# Altium schematic sheet WP75xx 2 no usb_v.SchDoc
size 302 x 466 mm; Origin: Eagle
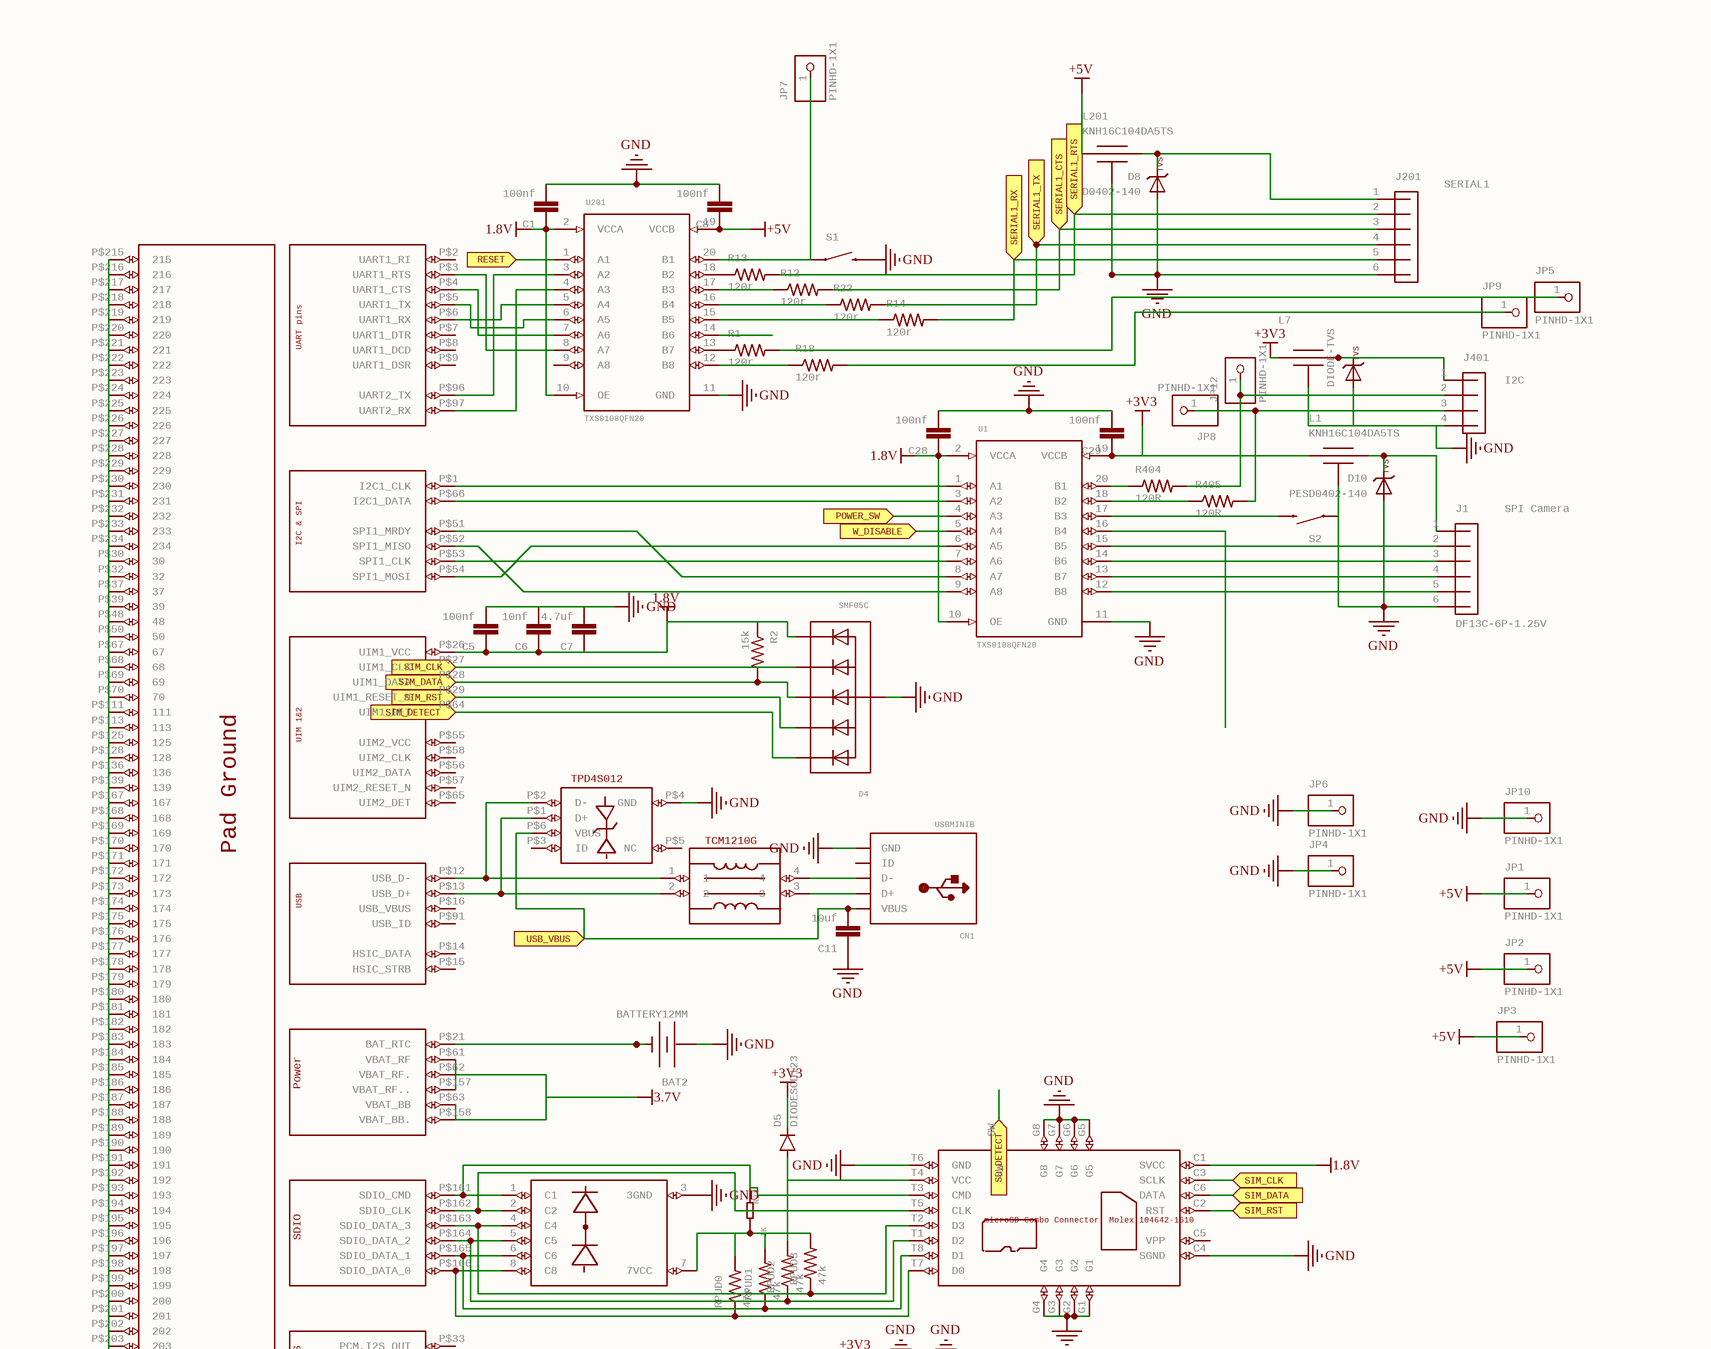
[diagram p0: WP75xx 2 no usb_v.SchDoc, top]
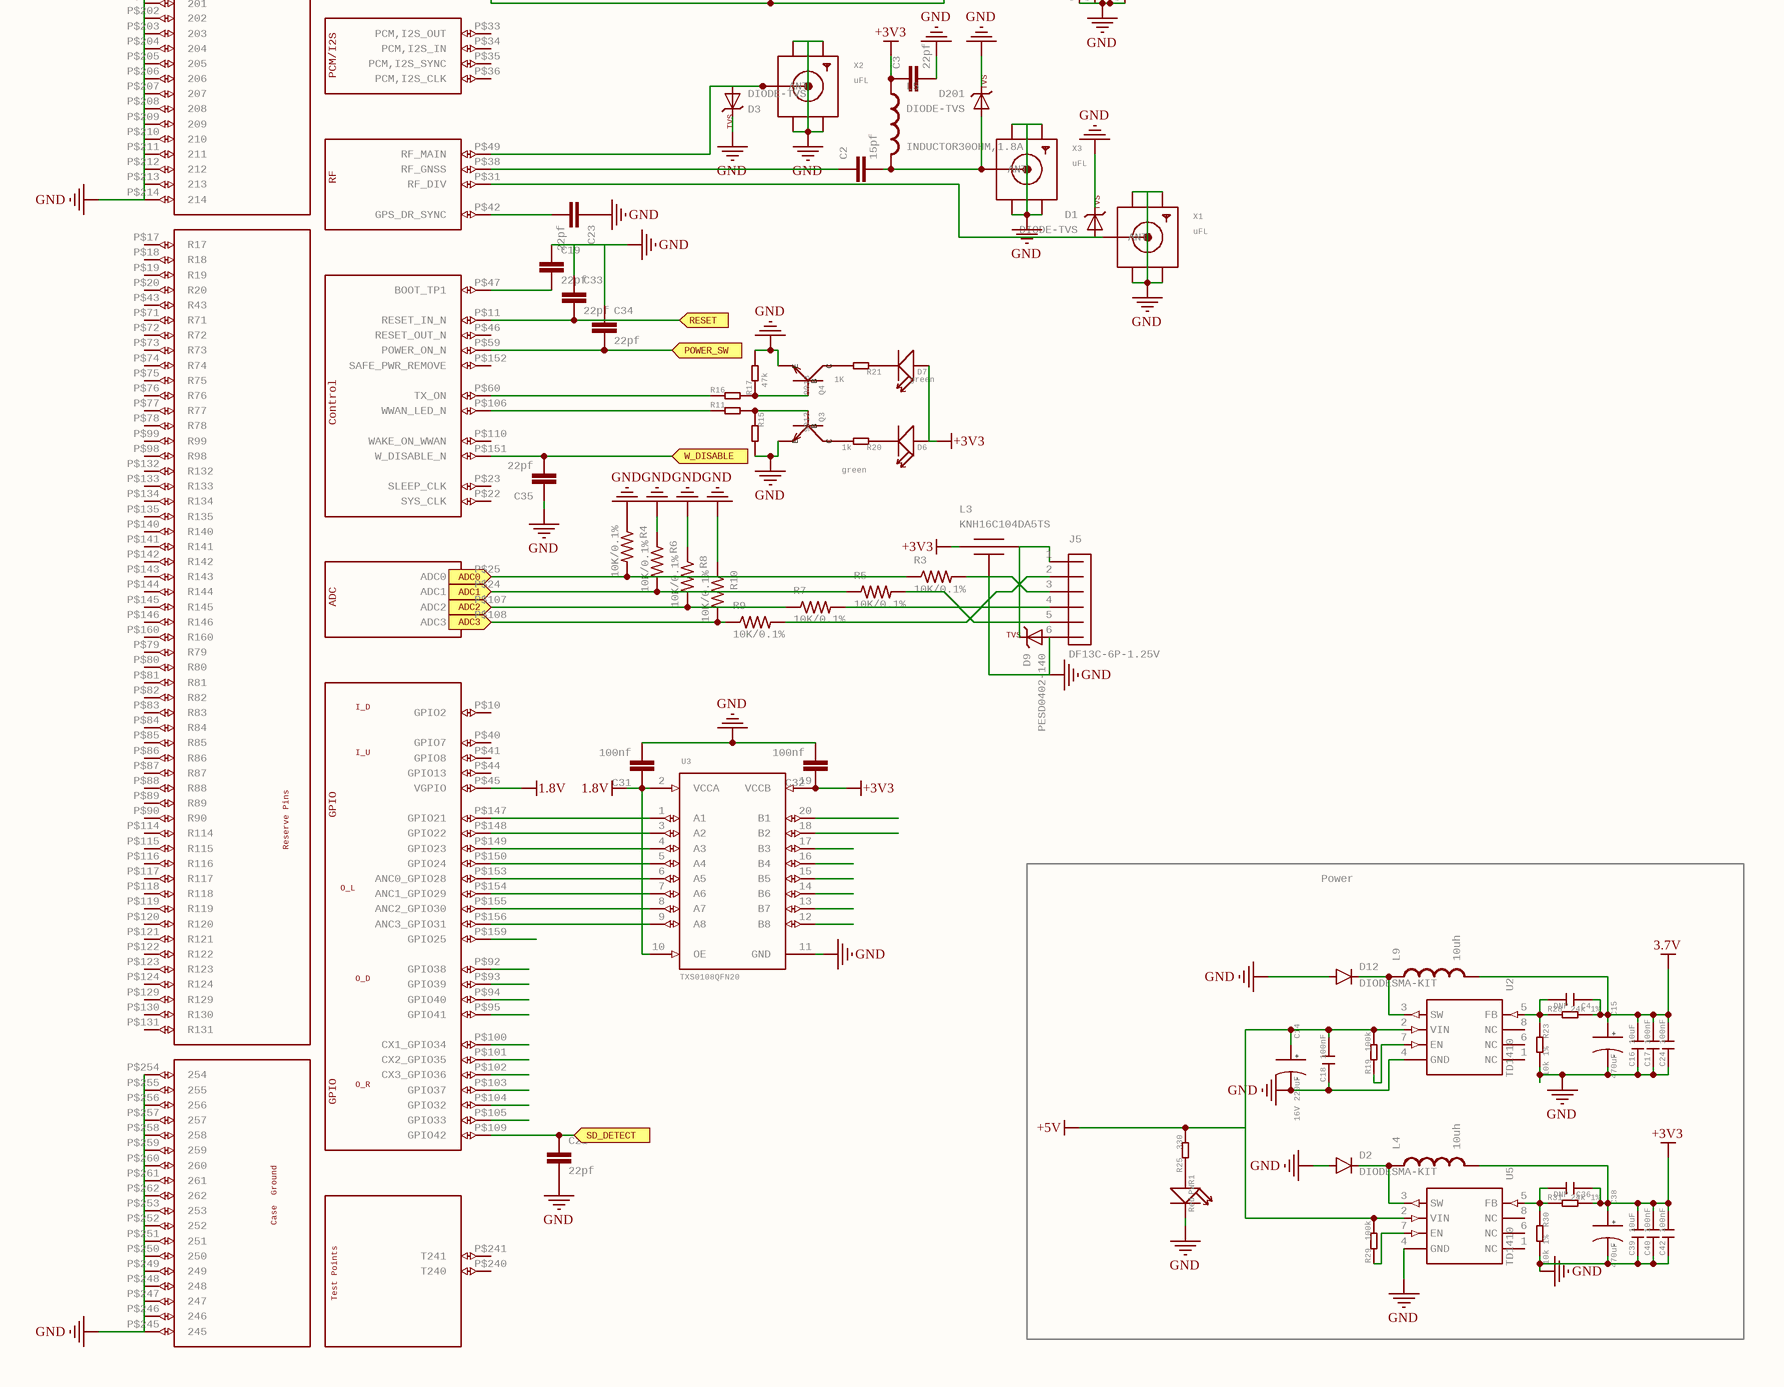
[diagram p1: WP75xx 2 no usb_v.SchDoc, bottom]

## Parts
BAT2  BATTERY12MM  [BATTCON_12MM]
C1  100nf  [0805-CAP]
C2  15pf  [0603-CAP]
C3  22pf  [0603-CAP]
C4  DNP  [C0603]
C5  100nf  [0805-CAP]
C6  10nf  [0805-CAP]
C7  4.7uf  [0805-CAP]
C8  100nf  [0805-CAP]
C11  10uf  [0603-CAP]
C14  16V 220uF  [ELECTRO-SMD-D-5.6MM]
C15  470uF  [AVX-D]
C16  10uF  [C0805]
C17  100nF  [C0603]
C18  100nF  [C0603]
C19  22pf  [0603-CAP]
C21  22pf  [0603-CAP]
C23  22pf  [0603-CAP]
C24  100nF  [C0603]
C28  100nf  [0805-CAP]
C29  100nf  [0805-CAP]
C31  100nf  [0805-CAP]
C32  100nf  [0805-CAP]
C33  22pf  [0603-CAP]
C34  22pf  [0603-CAP]
C35  22pf  [0603-CAP]
C36  DNP  [C0603]
C38  470uF  [AVX-D]
C39  10uF  [C0805]
C40  100nF  [C0603]
C42  100nF  [C0603]
CN1  USBMINIB  [USB-MINIB]
D1  DIODE-TVS  [0402-TVS]
D2  DIODESMA-KIT  [SMA-DIODE-KIT]
D3  DIODE-TVS  [0402-TVS]
D4  SMF05C  [SOT363]
D5  DIODESOD123  [SOD-123]
D6  green  [LED-0603]
D7  green  [LED-0603]
D8  PESD0402-140  [0402-TVS]
D9  PESD0402-140  [0402-TVS]
D10  PESD0402-140  [0402-TVS]
D12  DIODESMA-KIT  [SMA-DIODE-KIT]
D201  DIODE-TVS  [0402-TVS]
D401  DIODE-TVS  [0402-TVS]
J1  DF13C-6P-1.25V  [DF13C-6P-1.25V]
J5  DF13C-6P-1.25V  [DF13C-6P-1.25V]
J201  DF13-6P-1.25V  [DF13C-6P-1.25V]  (value not drawn)
J401  DF13-4P-1.25V  [DF13C-4P-1.25V]  (value not drawn)
JP1  PINHD-1X1  [1X01]
JP2  PINHD-1X1  [1X01]
JP3  PINHD-1X1  [1X01]
JP4  PINHD-1X1  [1X01]
JP5  PINHD-1X1  [1X01]
JP6  PINHD-1X1  [1X01]
JP7  PINHD-1X1  [1X01]
JP8  PINHD-1X1  [1X01]
JP9  PINHD-1X1  [1X01]
JP10  PINHD-1X1  [1X01]
JP12  PINHD-1X1  [1X01]
L1  KNH16C104DA5TS  [KYOCERA-KNH16-DA]
L3  KNH16C104DA5TS  [KYOCERA-KNH16-DA]
L4  10uh  [1210]
L5  INDUCTOR30OHM,1.8A  [0603]
L7  KNH16C104DA5TS  [KYOCERA-KNH16-DA]  (value not drawn)
L9  10uh  [1210]
L201  KNH16C104DA5TS  [KYOCERA-KNH16-DA]
PWR1  Red  [D0603]
Q3  9013  [SOT23]
Q4  9013  [SOT23]
R1  120r  [0603]
R2  15k  [0603]
R3  10K/0.1%  [0402-RES]
R4  10K/0.1%  [0402-RES]
R5  10K/0.1%  [0402-RES]
R6  10K/0.1%  [0402-RES]
R7  10K/0.1%  [0402-RES]
R8  10K/0.1%  [0402-RES]
R9  10K/0.1%  [0402-RES]
R10  10K/0.1%  [0402-RES]
R11  4.7k  [R0603]  (value not drawn)
R12  120r  [0603]
R13  120r  [0603]
R14  120r  [0603]
R15  47k  [R0603]  (value not drawn)
R16  4.7k  [R0603]  (value not drawn)
R17  47k  [R0603]
R18  120r  [0603]
R19  100k  [R0603]
R20  1k  [R0603]
R21  1K  [R0603]
R22  120r  [0603]
R23  10k 1%  [R0603]
R24  1K  [R0603]
R25  330  [R0603]
R28  24k 1%  [R0603]
R29  100k  [R0603]
R30  10k 1%  [R0603]
R31  24k 1%  [R0603]
R404  120R  [0402-RES]
R405  120R  [0402-RES]
RPUD0  47k  [0603]
RPUD1  47k  [0603]
RPUD2  47k  [0603]
RPUD3  47k  [0603]
S1  SWITCH-MOMENTARY-2SMD-1101NE  [TACTILE-SWITCH-1101NE]  (value not drawn)
S2  SWITCH-MOMENTARY-2SMD-1101NE  [TACTILE-SWITCH-1101NE]  (value not drawn)
U1  TXS0108QFN20  [QFN20-RGY]
U2  TD1410  [SOP8]
U3  TXS0108QFN20  [QFN20-RGY]
U5  TD1410  [SOP8]
U201  TXS0108QFN20  [QFN20-RGY]
U$1  PadGround: Pad Ground  CaseGround: Case  Ground  TestPoints: Test Points  ReservePins: Reserve Pins  UARTpins: UART pins  I2C&SPI: I2C & SPI  UIM1&2: UIM 1&2  [SOCKET_WP75XX]  (hidden comment: SOCKETY_WP75XXX)
U$11  TCM1210G  [TCM1210G]
U$12  TPD4S012  [TPD4S012]
U$14  microSDComboConnector
Molex104642-1610: microSD Combo Connector / Molex 104642-1610  [SIM_SD_HOLDER]  (hidden comment: SD_SIM_M1610)
U$15  PACDN006  [MSOP8]  (value not drawn)
X1  uFL  [SMA_EDGELAUNCH_UFL]
X2  uFL  [SMA_EDGELAUNCH_UFL]
X3  uFL  [SMA_EDGELAUNCH_UFL]

## Blocks framed on the sheet
Power: C4 C14-C18 C24 C36 C38-C40 C42 D2 D12 L4 L9 PWR1 R19 R23 R25 R28-R31 U2 U5

## Ports
ADC0 (in), ADC1 (in), ADC2 (in), ADC3 (in), POWER_SW (in), RESET (in), SD_DETECT (in), SERIAL1_CTS (in), SERIAL1_RTS (in), SERIAL1_RX (in), SERIAL1_TX (in), SIM_CLK (in), SIM_DATA (in), SIM_DETECT (in), SIM_RST (in), USB_VBUS (in), W_DISABLE (in)

## Nets
1.8V: C1.1 C5.1 C6.1 C7.1 C28.1 C31.1 D4.6(C5) R2.1 U1.2(VCCA) U1.10(OE) U3.2(VCCA) U3.10(OE) U201.2(VCCA) U201.10(OE) U$1.P$26(UIM1_VCC) U$1.P$45(VGPIO) U$14.C1(SVCC)
3.7V: C4.1 C15.+ C16.2 C17.2 C24.2 L9.2 R28.2 U$1.P$61(VBAT_RF) U$1.P$62(VBAT_RF.) U$1.P$63(VBAT_BB) U$1.P$157(VBAT_RF..) U$1.P$158(VBAT_BB.)
+3V3: C3.1 C29.1 C32.1 C36.1 C38.+ C39.2 C40.2 C42.2 D5.C D6.+ D7.+ L1.P$1 L3.P$1 L4.2 L5.1 L7.P$1 R31.2 U1.19(VCCB) U3.19(VCCB)
+5V: C8.1 C14.+ C18.2 JP1.1 JP2.1 JP3.1 L201.P$1 R19.2 R25.2 R29.2 U2.2(VIN) U5.2(VIN) U201.19(VCCB)
GND: BAT2.PWR@1(+) C1.2 C3.2 C5.2 C6.2 C7.2 C8.2 C11.1 C14.- C15.- C16.1 C17.1 C18.1 C19.1 C21.2 C23.1 C24.1 C28.2 C29.2 C31.2 C32.2 C33.1 C34.1 C35.1 C38.- C39.1 C40.1 C42.1 CN1.GND D1.C D2.A D3.C D4.2(A) D8.A D9.A D10.A D12.A D201.C D401.A J1.6 J5.3 J5.6 J201.6 J401.4 JP4.1 JP6.1 JP10.1 L1.P$3_P$4_P$5(P$3) L3.P$3_P$4_P$5(P$3) L7.P$3_P$4_P$5(P$3) L201.P$3_P$4_P$5(P$3) PWR1.- Q3.2(E) Q4.2(E) R3.P$2 R4.P$1 R6.P$1 R8.P$1 R10.P$1 R15.2 R17.2 R23.2 R30.2 S1.2 S2.1 U1.11(GND) U2.4(GND) U3.11(GND) U5.4(GND) U201.11(GND) U$1.P$30(30) U$1.P$32(32) U$1.P$37(37) U$1.P$39(39) U$1.P$48(48) U$1.P$50(50) U$1.P$67(67) U$1.P$68(68) U$1.P$69(69) U$1.P$70(70) U$1.P$111(111) U$1.P$113(113) U$1.P$125(125) U$1.P$128(128) U$1.P$136(136) U$1.P$139(139) U$1.P$167(167) U$1.P$168(168) U$1.P$169(169) U$1.P$170(170) U$1.P$171(171) U$1.P$172(172) U$1.P$173(173) U$1.P$174(174) U$1.P$175(175) U$1.P$176(176) U$1.P$177(177) U$1.P$178(178) U$1.P$179(179) U$1.P$180(180) U$1.P$181(181) U$1.P$182(182) U$1.P$183(183) U$1.P$184(184) U$1.P$185(185) U$1.P$186(186) U$1.P$187(187) U$1.P$188(188) U$1.P$189(189) U$1.P$190(190) U$1.P$191(191) U$1.P$192(192) U$1.P$193(193) U$1.P$194(194) U$1.P$195(195) U$1.P$196(196) U$1.P$197(197) U$1.P$198(198) U$1.P$199(199) U$1.P$200(200) U$1.P$201(201) U$1.P$202(202) U$1.P$203(203) U$1.P$204(204) U$1.P$205(205) U$1.P$206(206) U$1.P$207(207) U$1.P$208(208) U$1.P$209(209) U$1.P$210(210) U$1.P$211(211) U$1.P$212(212) U$1.P$213(213) U$1.P$214(214) U$1.P$215(215) U$1.P$216(216) U$1.P$217(217) U$1.P$218(218) U$1.P$219(219) U$1.P$220(220) U$1.P$221(221) U$1.P$222(222) U$1.P$223(223) U$1.P$224(224) U$1.P$225(225) U$1.P$226(226) U$1.P$227(227) U$1.P$228(228) U$1.P$229(229) U$1.P$230(230) U$1.P$231(231) U$1.P$232(232) U$1.P$233(233) U$1.P$234(234) U$1.P$245(245) U$1.P$246(246) U$1.P$247(247) U$1.P$248(248) U$1.P$249(249) U$1.P$250(250) U$1.P$251(251) U$1.P$252(252) U$1.P$253(253) U$1.P$254(254) U$1.P$255(255) U$1.P$256(256) U$1.P$257(257) U$1.P$258(258) U$1.P$259(259) U$1.P$260(260) U$1.P$261(261) U$1.P$262(262) U$12.P$4(GND) U$14.C4(SGND) U$14.G1 U$14.G2 U$14.G3 U$14.G4 U$14.G5 U$14.G6 U$14.G7 U$14.G8 U$14.T6(GND) U$15.3(3GND) X1.GND@1(GND1) X1.GND@2(GND2) X1.GND@3(GND3) X1.GND@4(GND4) X2.GND@1(GND1) X2.GND@2(GND2) X2.GND@3(GND3) X2.GND@4(GND4) X3.GND@1(GND1) X3.GND@2(GND2) X3.GND@3(GND3) X3.GND@4(GND4)
ADC0: R3.P$1 R4.P$2 U$1.P$25(ADC0) ; port ADC0
ADC1: R5.P$1 R6.P$2 U$1.P$24(ADC1) ; port ADC1
ADC2: R7.P$1 R8.P$2 U$1.P$107(ADC2) ; port ADC2
ADC3: R9.P$1 R10.P$2 U$1.P$108(ADC3) ; port ADC3
POWER_SW: C34.2 U1.4(A3) U$1.P$59(POWER_ON_N) ; port POWER_SW
RESET: C33.2 U201.1(A1) U$1.P$11(RESET_IN_N) ; port RESET
SD_DETECT: C21.1 U$1.P$109(GPIO42) U$14.SW ; port SD_DETECT
SERIAL1_CTS: J201.3 R12.2 ; port SERIAL1_CTS
SERIAL1_RTS: J201.2 R13.2 ; port SERIAL1_RTS
SERIAL1_RX: J201.5 R14.2 ; port SERIAL1_RX
SERIAL1_TX: J201.4 R22.2 ; port SERIAL1_TX
SIM_CLK: D4.5(C4) U$1.P$27(UIM1_CLK) U$14.C3(SCLK) ; port SIM_CLK
SIM_DATA: D4.4(C3) R2.2 U$1.P$28(UIM1_DATA) U$14.C6(DATA) ; port SIM_DATA
SIM_DETECT: D4.1(C1) U$1.P$64(UIM1_DET) ; port SIM_DETECT
SIM_RST: D4.3(C2) U$1.P$29(UIM1_RESET_N) U$14.C2(RST) ; port SIM_RST
USB_VBUS: C11.2 CN1.VBUS U$12.P$6(VBUS) ; port USB_VBUS
W_DISABLE: C35.2 U1.5(A4) U$1.P$151(W_DISABLE_N) ; port W_DISABLE
NetBAT2_GND: BAT2.GND(-) U$1.P$21(BAT_RTC)
NetC2_1: C2.1 U$1.P$38(RF_GNSS)
NetC2_2: C2.2 D201.A L5.2 X3.P(ANT)
NetC4_2: C4.2 R23.1 R28.1 U2.5(FB)
NetC19_2: C19.2 U$1.P$47(BOOT_TP1)
NetC23_2: C23.2 U$1.P$42(GPS_DR_SYNC)
NetC36_2: C36.2 R30.1 R31.1 U5.5(FB)
NetCN1_D+: CN1.D+ U$11.3
NetCN1_D-: CN1.D- U$11.4
NetD1_A: D1.A U$1.P$31(RF_DIV) X1.P(ANT)
NetD2_C: D2.C L4.1 U5.3(SW)
NetD3_A: D3.A U$1.P$49(RF_MAIN) X2.P(ANT)
NetD5_A: D5.A R24.2 RPUD0.2 RPUD1.2 RPUD2.2 RPUD3.2 U$14.T4(VCC) U$15.7(7VCC)
NetD6_-: D6.- R20.1
NetD7_-: D7.- R21.1
NetD8_C: D8.C J201.1 L201.P$2
NetD9_C: D9.C J5.1 L3.P$2
NetD10_C: D10.C J1.1 L1.P$2
NetD12_C: D12.C L9.1 U2.3(SW)
NetD401_C: D401.C J401.1 L7.P$2
NetJ1_2: J1.2 U1.15(B5)
NetJ1_3: J1.3 U1.14(B6)
NetJ1_4: J1.4 U1.13(B7)
NetJ1_5: J1.5 U1.12(B8)
NetJ5_2: J5.2 R9.P$2
NetJ5_4: J5.4 R7.P$2
NetJ5_5: J5.5 R5.P$2
NetJ401_2: J401.2 JP12.1 R404.P$2
NetJ401_3: J401.3 JP8.1 R405.P$2
NetJP5_1: JP5.1 R1.2
NetJP7_1: JP7.1 S1.1 U201.20(B1)
NetJP9_1: JP9.1 R18.2
NetPWR1_+: PWR1.+ R25.1
NetQ3_1: Q3.1(B) R11.2 R15.1
NetQ3_3: Q3.3(C) R20.2
NetQ4_1: Q4.1(B) R16.2 R17.1
NetQ4_3: Q4.3(C) R21.2
NetR1_1: R1.1 U201.13(B7)
NetR11_1: R11.1 U$1.P$106(WWAN_LED_N)
NetR12_1: R12.1 U201.17(B3)
NetR13_1: R13.1 U201.18(B2)
NetR14_1: R14.1 U201.15(B5)
NetR16_1: R16.1 U$1.P$60(TX_ON)
NetR18_1: R18.1 U201.12(B8)
NetR19_1: R19.1 U2.7(EN)
NetR22_1: R22.1 U201.16(B4)
NetR24_1: R24.1 U$1.P$161(SDIO_CMD) U$14.T3(CMD) U$15.1(C1)
NetR29_1: R29.1 U5.7(EN)
NetR404_P$1: R404.P$1 U1.20(B1)
NetR405_P$1: R405.P$1 U1.18(B2)
NetRPUD0_1: RPUD0.1 U$1.P$166(SDIO_DATA_0) U$14.T7(D0) U$15.8(C8)
NetRPUD1_1: RPUD1.1 U$1.P$165(SDIO_DATA_1) U$14.T8(D1) U$15.6(C6)
NetRPUD2_1: RPUD2.1 U$1.P$164(SDIO_DATA_2) U$14.T1(D2) U$15.5(C5)
NetRPUD3_1: RPUD3.1 U$1.P$163(SDIO_DATA_3) U$14.T2(D3) U$15.4(C4)
NetS2_2: S2.2 U1.17(B3)
NetU1_1: U1.1(A1) U$1.P$1(I2C1_CLK)
NetU1_3: U1.3(A2) U$1.P$66(I2C1_DATA)
NetU1_6: U1.6(A5) U$1.P$54(SPI1_MOSI)
NetU1_7: U1.7(A6) U$1.P$53(SPI1_CLK)
NetU1_8: U1.8(A7) U$1.P$51(SPI1_MRDY)
NetU1_9: U1.9(A8) U$1.P$52(SPI1_MISO)
NetU3_1: U3.1(A1) U$1.P$147(GPIO21)
NetU3_3: U3.3(A2) U$1.P$148(GPIO22)
NetU3_4: U3.4(A3) U$1.P$149(GPIO23)
NetU3_5: U3.5(A4) U$1.P$150(GPIO24)
NetU3_6: U3.6(A5) U$1.P$153(ANC0_GPIO28)
NetU3_7: U3.7(A6) U$1.P$154(ANC1_GPIO29)
NetU3_8: U3.8(A7) U$1.P$155(ANC2_GPIO30)
NetU3_9: U3.9(A8) U$1.P$156(ANC3_GPIO31)
NetU201_3: U201.3(A2) U$1.P$96(UART2_TX)
NetU201_4: U201.4(A3) U$1.P$97(UART2_RX)
NetU201_5: U201.5(A4) U$1.P$6(UART1_RX)
NetU201_6: U201.6(A5) U$1.P$5(UART1_TX)
NetU201_7: U201.7(A6) U$1.P$4(UART1_CTS)
NetU201_8: U201.8(A7) U$1.P$3(UART1_RTS)
NetU$1_P$12: U$1.P$12(USB_D-) U$11.1 U$12.P$2(D-)
NetU$1_P$13: U$1.P$13(USB_D+) U$11.2 U$12.P$1(D+)
NetU$1_P$162: U$1.P$162(SDIO_CLK) U$14.T5(CLK) U$15.2(C2)

Not connected (* = marked no-connect by the designer): CN1 ID; U1 16(B4); U2 1(NC) 6(NC) 8(NC); U3 12(B8) 13(B7) 14(B6) 15(B5) 16(B4) 17(B3) 18(B2) 20(B1); U5 1(NC) 6(NC) 8(NC); U201 9(A8) 14(B6); U$1 P$2(UART1_RI) P$7(UART1_DTR) P$8(UART1_DCD) P$9(UART1_DSR) P$10(GPIO2) P$14(HSIC_DATA) P$15(HSIC_STRB) P$16(USB_VBUS) P$17(R17) P$18(R18) P$19(R19) P$20(R20) P$22(SYS_CLK) P$23(SLEEP_CLK) P$33(PCM,I2S_OUT) P$34(PCM,I2S_IN) P$35(PCM,I2S_SYNC) P$36(PCM,I2S_CLK) P$40(GPIO7) P$41(GPIO8) P$43(R43) P$44(GPIO13) P$46(RESET_OUT_N) P$55(UIM2_VCC) P$56(UIM2_DATA) P$57(UIM2_RESET_N) P$58(UIM2_CLK) P$65(UIM2_DET) P$71(R71) P$72(R72) P$73(R73) P$74(R74) P$75(R75) P$76(R76) P$77(R77) P$78(R78) P$79(R79) P$80(R80) P$81(R81) P$82(R82) P$83(R83) P$84(R84) P$85(R85) P$86(R86) P$87(R87) P$88(R88) P$89(R89) P$90(R90) P$91(USB_ID) P$92(GPIO38) P$93(GPIO39) P$94(GPIO40) P$95(GPIO41) P$98(R98) P$99(R99) P$100(CX1_GPIO34) P$101(CX2_GPIO35) P$102(CX3_GPIO36) P$103(GPIO37) P$104(GPIO32) P$105(GPIO33) P$110(WAKE_ON_WWAN) P$114(R114) P$115(R115) P$116(R116) P$117(R117) P$118(R118) P$119(R119) P$120(R120) P$121(R121) P$122(R122) P$123(R123) P$124(R124) P$129(R129) P$130(R130) P$131(R131) P$132(R132) P$133(R133) P$134(R134) P$135(R135) P$140(R140) P$141(R141) P$142(R142) P$143(R143) P$144(R144) P$145(R145) P$146(R146) P$152(SAFE_PWR_REMOVE) P$159(GPIO25) P$160(R160) P$240(T240) P$241(T241); U$12 P$3(ID) P$5(NC); U$14 C5(VPP)

## Notes on the sheet
- (near J201) SERIAL1
- I2C
- (near J1) SPI Camera

## Library data of the parts
BAT2 = BATTERY12MM: Battery Holders Various common sizes : AA, AAA, 18650 (PRT-12895), 20mm coin cell and 12mm coin cell. 20MM_4LEGS, BATT-10373; GateName_1: G$1; PROD_ID: BATT-08044; SymbolName_1: BATTERY; DeviceName: 12MM; LibraryName: SparkFun-Electromechanical; DeviceSetName: BATTERY
C1 C5-C8 C28 C29 C31 C32 = 1.0UF-25V-+80/-20(0805)": CAP-11625; GateName_1: G$1; SymbolName_1: CAP; DeviceName: "; LibraryName: SparkFun-Capacitors; DeviceSetName: 1.0UF-25V-+80/-20(0805)
C2 C3 C11 C19 C21 C23 C33-C35 = 0.1UF-25V(+80/-20%)(0603): CAP-00810 Ceramic Standard decoupling cap; GateName_1: G$1; SymbolName_1: CAP; LibraryName: SparkFun-Capacitors; DeviceSetName: 0.1UF-25V(+80/-20%)(0603); PROD_ID: CAP-00810
C4 C17 C18 C24 C36 C40 C42 = C*-0603: Ceramic Capacitors; GateName_1: C; DeviceName: -0603; DeviceSetName: C*; SymbolName_1: C; LibraryName: Discrete
C14 = CAP*-ELECTRO-D: Electrolytic Capacitors,Tantalum Capacitors and Super Capacitors; GateName_1: C; DeviceSetName: CAP*; SymbolName_1: CAPACITOR; DeviceName: -ELECTRO-D; LibraryName: Discrete; +: +; -: -
C15 C38 = CAP*-AVX-D: Electrolytic Capacitors,Tantalum Capacitors and Super Capacitors; GateName_1: C; DeviceName: -AVX-D; DeviceSetName: CAP*; SymbolName_1: CAPACITOR; LibraryName: Discrete; +: +; -: -
C16 C39 = C*-0805: Ceramic Capacitors; GateName_1: C; DeviceName: -0805; DeviceSetName: C*; SymbolName_1: C; LibraryName: Discrete
CN1 = USBMINIB: USB ConnectorsUSBMINIB - Surface Mount Female Mini-B USB Connector 4UConnector: 06564   By microbuilder.euThru-hole RA Female Mini-B USB Connector 4UConnector: 18732   By ladyada.net; GateName_1: G$1; DeviceName: MINIB; SymbolName_1: USB; LibraryName: adafruit; DeviceSetName: USB
D1 D3 D201 D401 = DIODE-TVS: PARTNO: PESD0402-140; GateName_1: G$1; SymbolName_1: DIODE-TVS; LibraryName: pixhawk2; DeviceSetName: DIODE-TVS; TVS: TVS
D2 D12 = DIODESMA-KIT: DiodeThese are standard reverse protection diodes and small signal diodes. SMA package can handle up to about 1A. SOD-323 can handle about 200mA. What the SOD-323 package when ordering, there are some mfgs out there that are 5-pin packages.; GateName_1: G$1; SymbolName_1: DIODE; DeviceName: SMA-KIT; LibraryName: SparkFun-DiscreteSemi; DeviceSetName: DIODE
D4 = TVSARRAY_5LANE: Voltage Transient Suppressor Array   SOT363 SMF05C - 100W 5V: Digikey - SMF05CT1GOSCT-ND; GateName_1: G$1; SymbolName_1: TVSARRAY_5LANE; LibraryName: microbuilder; DeviceSetName: TVSARRAY_5LANE
D5 = DIODESOD123: DiodeThese are standard reverse protection diodes and small signal diodes. SMA package can handle up to about 1A. SOD-323 can handle about 200mA. What the SOD-323 package when ordering, there are some mfgs out there that are 5-pin packages.; GateName_1: G$1; SymbolName_1: DIODE; DeviceName: SOD123; LibraryName: SparkFun-DiscreteSemi; DeviceSetName: DIODE
D6 D7 = LED*'0603': GateName_1: LED; DeviceName: '0603'; DeviceSetName: LED*; SymbolName_1: LED; LibraryName: Discrete
D8-D10 = DIODE-TVS: GateName_1: G$1; SymbolName_1: DIODE-TVS; LibraryName: pixhawk2; DeviceSetName: DIODE-TVS; TVS: TVS; PARTNO: PESD0402-140
J1 J5 J201 = DF13-6P-1.25V: DF13-6P 1.25mm Pitch Miniature Crimping Connector.; GateName_1: G$1; SymbolName_1: CON-1X6P; DeviceName: V; LibraryName: con-hirose-df13; DeviceSetName: DF13-6P-1.25; PARTNO: PARTNO
J401 = DF13-4P-1.25V: DF13-4P 1.25mm Pitch Miniature Crimping Connector.; GateName_1: G$1; SymbolName_1: CON-1X4P; DeviceName: V; LibraryName: con-hirose-df13; DeviceSetName: DF13-4P-1.25; PARTNO: PARTNO
JP1-JP10 JP12 = PINHD-1X1: PIN HEADER; GateName_1: G$1; SymbolName_1: PINHD1; LibraryName: pinhead2; DeviceSetName: PINHD-1X1
L1 L3 L7 L201 = KNH16C104DA5TS: Kyocera KNH16C104DA5TS EMI filter; GateName_1: G$1; SymbolName_1: CAP-FEEDTHROUGH; LibraryName: pixhawk2; DeviceSetName: KNH16C104DA5TS; PARTNO: PARTNO
L4 L9 = INDUCTOR1210: Inductors   Basic Inductor/Choke - 0603 and 1206. Footprints are not proven and vary greatly between part numbers. SRN6045- 33uH, 20% 1.4A SDR0403-560KL - 56uH, 10%, 500mA RMS/740mA peak; GateName_1: G$1; SymbolName_1: INDUCTOR; DeviceName: 1210; LibraryName: SparkFun-Passives; DeviceSetName: INDUCTOR
L5 = INDUCTOR30OHM,1.8A: Inductors   Basic Inductor/Choke - 0603 and 1206. Footprints are not proven and vary greatly between part numbers. SRN6045- 33uH, 20% 1.4A SDR0403-560KL - 56uH, 10%, 500mA RMS/740mA peak; GateName_1: G$1; PROD_ID: RES-07859; SymbolName_1: INDUCTOR; DeviceName: 30OHM,1.8A; LibraryName: SparkFun-Passives; DeviceSetName: INDUCTOR
PWR1 = 007-LED*0603: GateName_1: LED; DeviceName: 0603; SymbolName_1: LED; LibraryName: Discrete; DeviceSetName: 007-LED*
Q3 Q4 = TRANSISTOR-NPN*-SOT23: NPN audion; GateName_1: G$1; DeviceName: -SOT23; SymbolName_1: NPN; LibraryName: Discrete; DeviceSetName: TRANSISTOR-NPN*; B: B; C: C; E: E
R1 R2 R12-R14 R18 R22 RPUD0-RPUD3 = 0.05OHM-1/5W-1%(0603): GateName_1: G$1; SymbolName_1: RESISTOR; PROD_ID: RES-12535; LibraryName: SparkFun-Resistors; DeviceSetName: 0.05OHM-1/5W-1%(0603)
R3-R10 R404 R405 = RESISTOR0402-RES: ResistorBasic schematic elements and footprints for 0603, 1206, and PTH 1/10th watt (small) resistors.; GateName_1: G$1; SymbolName_1: RESISTOR; DeviceName: 0402-RES; LibraryName: pixhawk2; DeviceSetName: RESISTOR; PARTNO: PARTNO
R11 R15-R17 R19-R21 R23-R25 R28-R31 = R*-0603: GateName_1: R; DeviceName: -0603; DeviceSetName: R*; SymbolName_1: R; LibraryName: Discrete
S1 S2 = SWITCH-MOMENTARY-2SMD-1101NE: Various NO switches- pushbuttons, reed, etc; GateName_1: G$1; PROD_ID: SWCH-00815; SymbolName_1: SWITCH-MOMENTARY-2; DeviceName: SMD-1101NE; LibraryName: SparkFun-Electromechanical; DeviceSetName: SWITCH-MOMENTARY-2
U1 U3 U201 = TXS0108QFN20: GateName_1: G$1; SymbolName_1: TX?0108; DeviceName: QFN20; LibraryName: pixhawk2; DeviceSetName: TXS0108; PARTNO: PARTNO
U2 U5 = TD1410: 2A 380KHz 20V PWM Buck DC/DC Converter; GateName_1: G$1; SymbolName_1: TD1410; LibraryName: template; DeviceSetName: TD1410
U$1 = SOCKETY_WP75XXX: GateName_1: G$1; SymbolName_1: SOCKE_WP75XX; LibraryName: sierra wireless; DeviceSetName: SOCKETY_WP75XXX; USB: USB; Power: Power; SDIO: SDIO; ADC: ADC; GPIO: GPIO; RF: RF; PCM/I2S: PCM/I2S; Control: Control; I_D: I_D; I_U: I_U; O_L: O_L; O_D: O_D; O_R: O_R
U$11 = TCM1210G: GateName_1: G$1; SymbolName_1: TCM1210G; LibraryName: My_MODULE; DeviceSetName: TCM1210G; TCM1210G: TCM1210G
U$12 = TPD4S012: GateName_1: G$1; SymbolName_1: TPD4S012; LibraryName: My_MODULE; DeviceSetName: TPD4S012; TPD4S012: TPD4S012
U$14 = SD_SIM_M1610: GateName_1: G$1; SymbolName_1: SIM_SD_HOLDER; LibraryName: My_MODULE; DeviceSetName: SD_SIM_M1610
U$15 = PACDN006: GateName_1: G$1; SymbolName_1: PACDN006; LibraryName: My_MODULE; DeviceSetName: PACDN006
X1-X3 = SMACONNECTOR_EDGE_UFL: SMA Connector   90آ° DIP SMA Connector, 50 Ohm (4UConnector: 07259); GateName_1: G$1; SymbolName_1: SMACONNECTOR; DeviceName: _EDGE_UFL; LibraryName: microbuilder; DeviceSetName: SMACONNECTOR